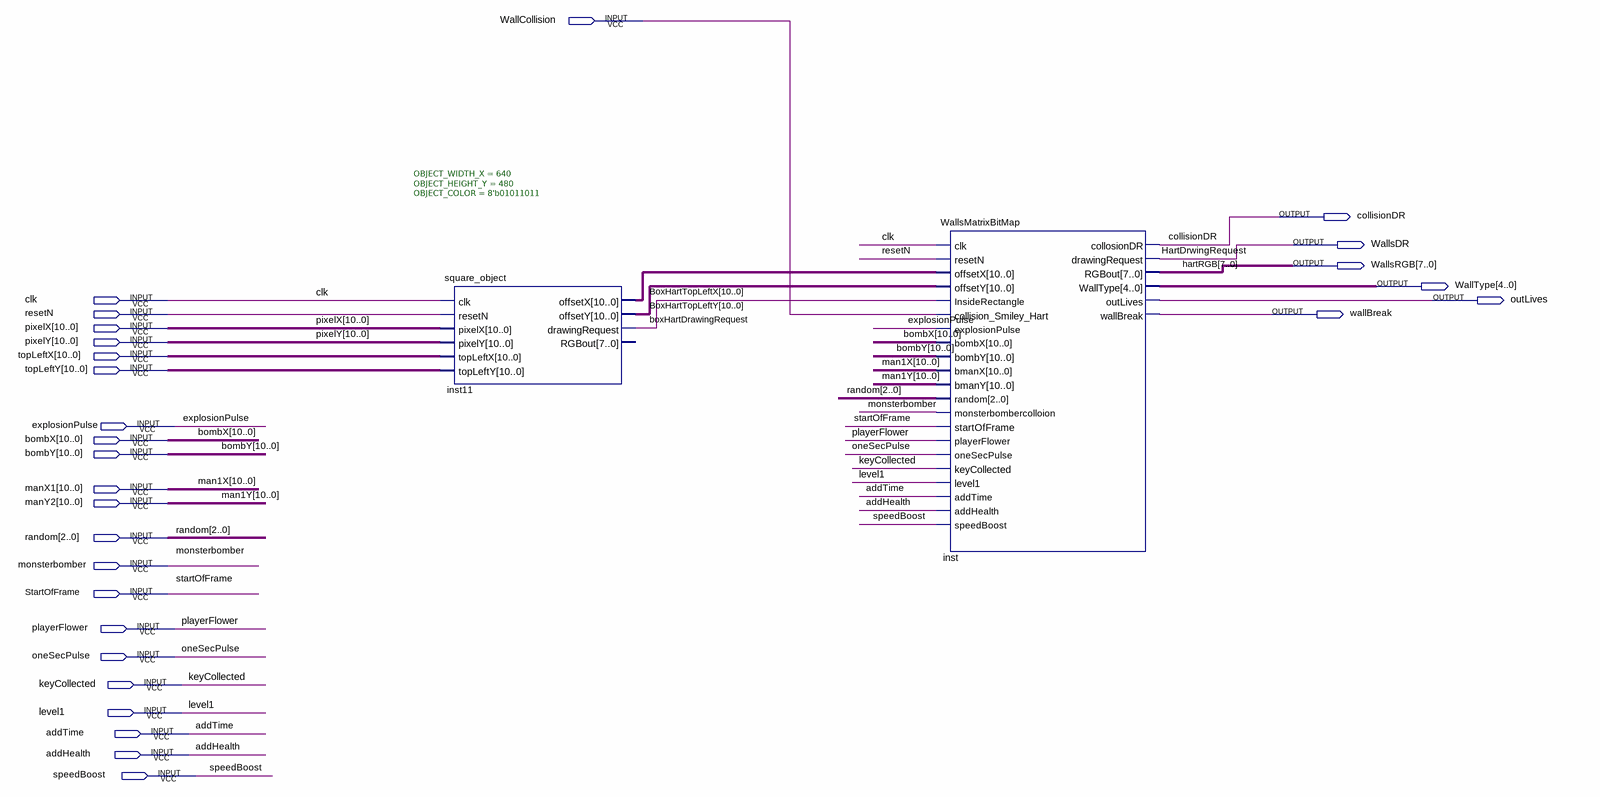
[diagram p0: schematic sheet]
// Quartus schematic WallsBlock.bdf as structural Verilog: 2 symbols, 28 pins
module WallsBlock (
  input  WallCollision,
  input  clk,
  input  resetN,
  input  [10:0] pixelX,
  input  [10:0] pixelY,
  input  [10:0] topLeftX,
  input  [10:0] topLeftY,
  input  explosionPulse,
  input  [10:0] bombX,
  input  [10:0] bombY,
  input  [10:0] manX1,
  input  [10:0] manY2,
  input  [2:0] random,
  input  monsterbomber,
  input  StartOfFrame,
  input  playerFlower,
  input  oneSecPulse,
  input  keyCollected,
  input  level1,
  input  addTime,
  input  addHealth,
  input  speedBoost,
  output collisionDR,
  output WallsDR,
  output [7:0] WallsRGB,
  output [4:0] WallType,
  output outLives,
  output wallBreak
);

  wire boxHartDrawingRequest;
  wire [10:0] BoxHartTopLeftX, BoxHartTopLeftY;

  square_object #(.OBJECT_WIDTH_X(640), .OBJECT_HEIGHT_Y(480), .OBJECT_COLOR(8'b01011011)) inst11 (
    .clk(clk), .resetN(resetN), .pixelX(pixelX), .pixelY(pixelY), .topLeftX(topLeftX), .topLeftY(topLeftY),
    .offsetX(BoxHartTopLeftX), .offsetY(BoxHartTopLeftY), .drawingRequest(boxHartDrawingRequest));  // open: RGBout
  WallsMatrixBitMap inst (
    .clk(clk), .resetN(resetN), .offsetX(BoxHartTopLeftX), .offsetY(BoxHartTopLeftY),
    .InsideRectangle(boxHartDrawingRequest), .collision_Smiley_Hart(WallCollision),
    .explosionPulse(explosionPulse), .bombX(bombX), .bombY(bombY), .bmanX(manX1), .bmanY(manY2),
    .random(random), .monsterbombercolloion(monsterbomber), .startOfFrame(StartOfFrame),
    .playerFlower(playerFlower), .oneSecPulse(oneSecPulse), .keyCollected(keyCollected), .level1(level1),
    .addTime(addTime), .addHealth(addHealth), .speedBoost(speedBoost), .collosionDR(collisionDR),
    .drawingRequest(WallsDR), .RGBout(WallsRGB), .WallType(WallType), .outLives(outLives),
    .wallBreak(wallBreak));

  // Other names for the same wires on the sheet: HartDrwingRequest = WallsDR; hartRGB[7:0] = WallsRGB;
  //   man1X[10:0] = manX1; man1Y[10:0] = manY2
endmodule
